# Altium project SplitHE_Int.PrjPcb
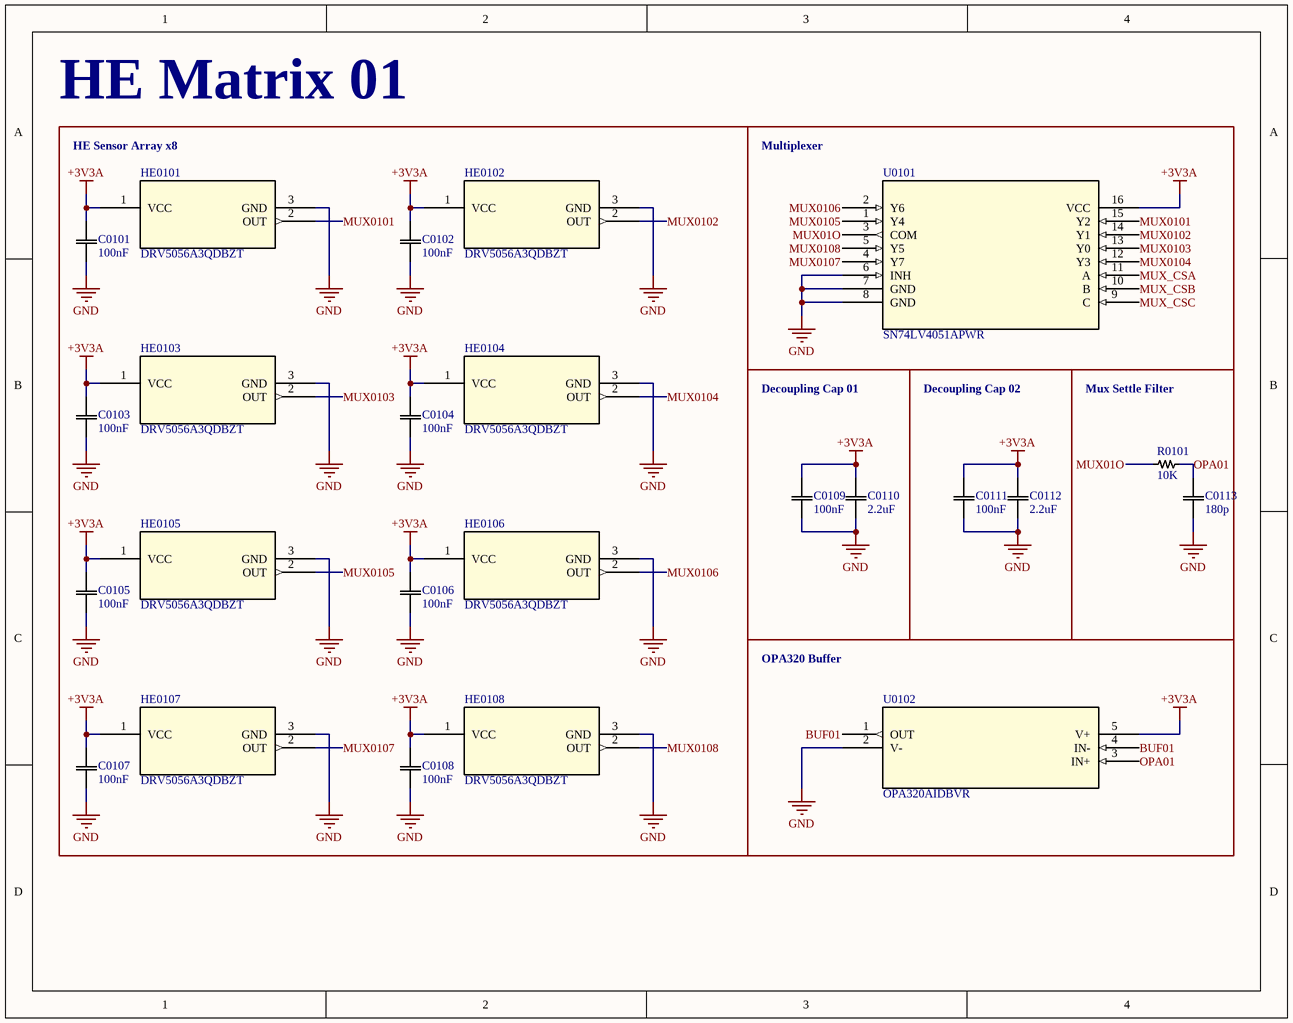
[diagram p0: sensor_matrix_01.SchDoc]
5 sheets, 121 parts. Net scope: global (net labels, ports and power ports of the same name join across sheets).
Board file: main.PcbDoc
Sheets:
  sensor_matrix_01.SchDoc
  sensor_matrix_02.SchDoc
  sensor_matrix_03.SchDoc
  rp2040_core.SchDoc
  peripherals.SchDoc

## Sheet sensor_matrix_01.SchDoc
size A; SheetNumber: 1; SheetTotal: 5

### Parts
C0101  100nF  [CAPC10555_55N_KEM]
C0102  100nF  [CAPC10555_55N_KEM]
C0103  100nF  [CAPC10555_55N_KEM]
C0104  100nF  [CAPC10555_55N_KEM]
C0105  100nF  [CAPC10555_55N_KEM]
C0106  100nF  [CAPC10555_55N_KEM]
C0107  100nF  [CAPC10555_55N_KEM]
C0108  100nF  [CAPC10555_55N_KEM]
C0109  100nF  [CAPC10555_55N_KEM]
C0110  2.2uF  [CAPC10555_55N_KEM]
C0111  100nF  [CAPC10555_55N_KEM]
C0112  2.2uF  [CAPC10555_55N_KEM]
C0113  180p  [CAPC10555_55N_KEM]
HE0101  DRV5056A3QDBZT  [DBZ3_TEX]
HE0102  DRV5056A3QDBZT  [DBZ3_TEX]
HE0103  DRV5056A3QDBZT  [DBZ3_TEX]
HE0104  DRV5056A3QDBZT  [DBZ3_TEX]
HE0105  DRV5056A3QDBZT  [DBZ3_TEX]
HE0106  DRV5056A3QDBZT  [DBZ3_TEX]
HE0107  DRV5056A3QDBZT  [DBZ3_TEX]
HE0108  DRV5056A3QDBZT  [DBZ3_TEX]
R0101  10K  [RES0402_CPF_TYCO_TYC]
U0101  SN74LV4051APWR  [PW16]
U0102  OPA320AIDBVR  [DBV5]

### Blocks framed on the sheet
HE Matrix 01: C0101 C0102 C0103 C0104 C0105 C0106 C0107 C0108 HE0101 HE0102 HE0103 HE0104 HE0105 HE0106 HE0107 HE0108
Multiplexer: U0101
OPA320 Buffer: U0102

### Nets
+3V3A: C0101.2 C0102.2 C0103.2 C0104.2 C0105.2 C0106.2 C0107.2 C0108.2 C0109.2 C0110.2 C0111.2 C0112.2 HE0101.1(VCC) HE0102.1(VCC) HE0103.1(VCC) HE0104.1(VCC) HE0105.1(VCC) HE0106.1(VCC) HE0107.1(VCC) HE0108.1(VCC) U0101.16(VCC) U0102.5(V+)
GND: C0101.1 C0102.1 C0103.1 C0104.1 C0105.1 C0106.1 C0107.1 C0108.1 C0109.1 C0110.1 C0111.1 C0112.1 C0113.1 HE0101.3(GND) HE0102.3(GND) HE0103.3(GND) HE0104.3(GND) HE0105.3(GND) HE0106.3(GND) HE0107.3(GND) HE0108.3(GND) U0101.6(INH) U0101.7(GND) U0101.8(GND) U0102.2(V-)
BUF01: U0102.1(OUT) U0102.4(IN-)
MUX01O: R0101.2 U0101.3(COM)
MUX0101: HE0101.2(OUT) U0101.15(Y2)
MUX0102: HE0102.2(OUT) U0101.14(Y1)
MUX0103: HE0103.2(OUT) U0101.13(Y0)
MUX0104: HE0104.2(OUT) U0101.12(Y3)
MUX0105: HE0105.2(OUT) U0101.1(Y4)
MUX0106: HE0106.2(OUT) U0101.2(Y6)
MUX0107: HE0107.2(OUT) U0101.4(Y7)
MUX0108: HE0108.2(OUT) U0101.5(Y5)
MUX_CSA: U0101.11(A)
MUX_CSB: U0101.10(B)
MUX_CSC: U0101.9(C)
OPA01: C0113.2 R0101.1 U0102.3(IN+)

### Notes on the sheet
- HE Sensor Array x8
- Decoupling Cap 01
- Decoupling Cap 02
- Mux Settle Filter

### Library data of the parts
C0101 C0102 C0103 C0104 C0105 C0106 C0107 C0108 C0109 C0110 C0111 C0112 C0113 = C0402: SMD Comm X7R, Ceramic, SMD, MLCC, Temperature Stable, 0402; Manufacturer_Name: Kemet; Manufacturer_Part_Number: C0402C104K4RACTU; Copyright: Copyright (C) 2025 Ultra Librarian. All rights reserved.; Datasheet: https://content.kemet.com/datasheets/KEM_C1002_X7R_SMD.pdf
HE0101 HE0102 HE0103 HE0104 HE0105 HE0106 HE0107 HE0108 = DRV5056A3QDBZT: Ratiometric unipolar linear hall effect sensor with analog output 3-SOT-23 -40 to 125; Manufacturer_Name: Texas Instruments; Copyright: Copyright (C) 2025 Ultra Librarian. All rights reserved.; Manufacturer_Part_Number: DRV5056A3QDBZT; Datasheet: https://www.ti.com/lit/gpn/drv5056; RefDes: RefDes; Type: Type
R0101 = R0402: CPF 0402 RL; Manufacturer_Name: TE Connectivity; Manufacturer_Part_Number: CPF0402B33RE1; Copyright: Copyright (C) 2025 Ultra Librarian. All rights reserved.; Datasheet: https://www.te.com/commerce/DocumentDelivery/DDEController?Action=srchrtrv&DocNm=1773200&DocType=Data+Sheet&DocLang=English&PartCntxt=1-1879208-3&DocFormat=pdf
U0101 = SN74LV4051APWR: 5V 8:1 one-channel general-purpose analog multiplexer 16-TSSOP -40 to 85; Manufacturer_Name: Texas Instruments; Copyright: Copyright (C) 2025 Ultra Librarian. All rights reserved.; Manufacturer_Part_Number: SN74LV4051APWR; Datasheet: https://www.ti.com/lit/gpn/sn74lv4051a; RefDes: RefDes; Type: Type
U0102 = OPA320AIDBVR: Precision, zero-crossover, 20-MHz, 0.9-pA Ib, RRIO, CMOS operational amplifier 5-SOT-23 -40 to 125; Manufacturer_Name: Texas Instruments; Copyright: Copyright (C) 2025 Ultra Librarian. All rights reserved.; Manufacturer_Part_Number: OPA320AIDBVR; Datasheet: https://www.ti.com/lit/gpn/opa320; RefDes: RefDes; Type: Type

## Sheet sensor_matrix_02.SchDoc
size A; SheetNumber: 2; SheetTotal: 5
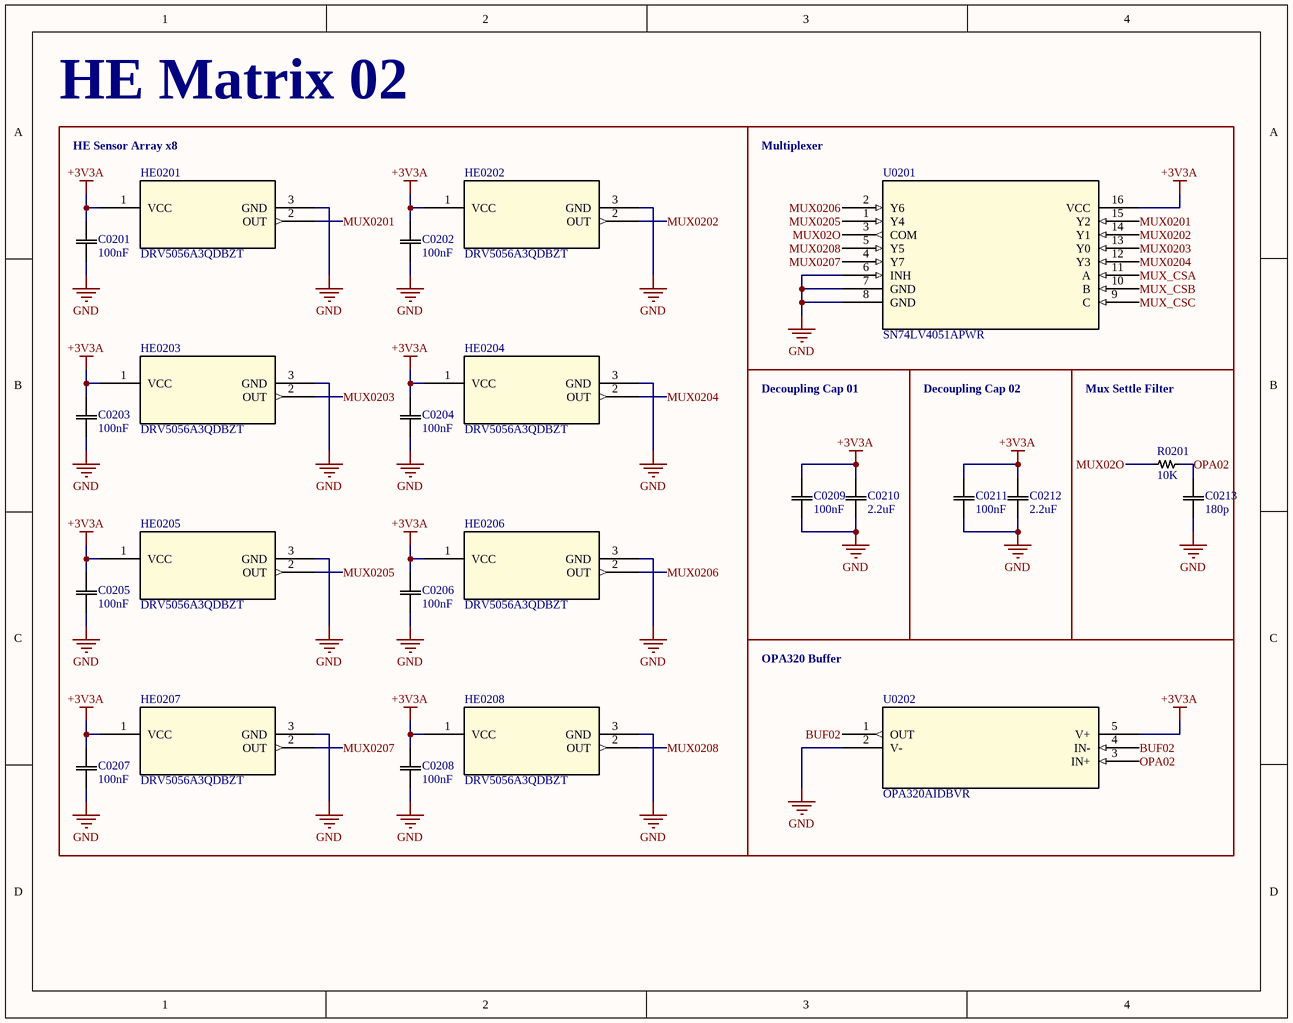
[diagram p1: sensor_matrix_02.SchDoc]

### Parts
C0201  100nF  [CAPC10555_55N_KEM]
C0202  100nF  [CAPC10555_55N_KEM]
C0203  100nF  [CAPC10555_55N_KEM]
C0204  100nF  [CAPC10555_55N_KEM]
C0205  100nF  [CAPC10555_55N_KEM]
C0206  100nF  [CAPC10555_55N_KEM]
C0207  100nF  [CAPC10555_55N_KEM]
C0208  100nF  [CAPC10555_55N_KEM]
C0209  100nF  [CAPC10555_55N_KEM]
C0210  2.2uF  [CAPC10555_55N_KEM]
C0211  100nF  [CAPC10555_55N_KEM]
C0212  2.2uF  [CAPC10555_55N_KEM]
C0213  180p  [CAPC10555_55N_KEM]
HE0201  DRV5056A3QDBZT  [DBZ3_TEX]
HE0202  DRV5056A3QDBZT  [DBZ3_TEX]
HE0203  DRV5056A3QDBZT  [DBZ3_TEX]
HE0204  DRV5056A3QDBZT  [DBZ3_TEX]
HE0205  DRV5056A3QDBZT  [DBZ3_TEX]
HE0206  DRV5056A3QDBZT  [DBZ3_TEX]
HE0207  DRV5056A3QDBZT  [DBZ3_TEX]
HE0208  DRV5056A3QDBZT  [DBZ3_TEX]
R0201  10K  [RES0402_CPF_TYCO_TYC]
U0201  SN74LV4051APWR  [PW16]
U0202  OPA320AIDBVR  [DBV5]

### Blocks framed on the sheet
HE Matrix 02: C0201 C0202 C0203 C0204 C0205 C0206 C0207 C0208 HE0201 HE0202 HE0203 HE0204 HE0205 HE0206 HE0207 HE0208
Multiplexer: U0201
OPA320 Buffer: U0202

### Nets
+3V3A: C0201.2 C0202.2 C0203.2 C0204.2 C0205.2 C0206.2 C0207.2 C0208.2 C0209.2 C0210.2 C0211.2 C0212.2 HE0201.1(VCC) HE0202.1(VCC) HE0203.1(VCC) HE0204.1(VCC) HE0205.1(VCC) HE0206.1(VCC) HE0207.1(VCC) HE0208.1(VCC) U0201.16(VCC) U0202.5(V+)
GND: C0201.1 C0202.1 C0203.1 C0204.1 C0205.1 C0206.1 C0207.1 C0208.1 C0209.1 C0210.1 C0211.1 C0212.1 C0213.1 HE0201.3(GND) HE0202.3(GND) HE0203.3(GND) HE0204.3(GND) HE0205.3(GND) HE0206.3(GND) HE0207.3(GND) HE0208.3(GND) U0201.6(INH) U0201.7(GND) U0201.8(GND) U0202.2(V-)
BUF02: U0202.1(OUT) U0202.4(IN-)
MUX02O: R0201.2 U0201.3(COM)
MUX0201: HE0201.2(OUT) U0201.15(Y2)
MUX0202: HE0202.2(OUT) U0201.14(Y1)
MUX0203: HE0203.2(OUT) U0201.13(Y0)
MUX0204: HE0204.2(OUT) U0201.12(Y3)
MUX0205: HE0205.2(OUT) U0201.1(Y4)
MUX0206: HE0206.2(OUT) U0201.2(Y6)
MUX0207: HE0207.2(OUT) U0201.4(Y7)
MUX0208: HE0208.2(OUT) U0201.5(Y5)
MUX_CSA: U0201.11(A)
MUX_CSB: U0201.10(B)
MUX_CSC: U0201.9(C)
OPA02: C0213.2 R0201.1 U0202.3(IN+)

### Notes on the sheet
- HE Sensor Array x8
- Decoupling Cap 01
- Decoupling Cap 02
- Mux Settle Filter

### Library data of the parts
C0201 C0202 C0203 C0204 C0205 C0206 C0207 C0208 C0209 C0210 C0211 C0212 C0213 = C0402: as C0101 on sheet sensor_matrix_01; Copyright: Copyright (C) 2025 Ultra Librarian. All rights reserved.; Datasheet: https://content.kemet.com/datasheets/KEM_C1002_X7R_SMD.pdf
HE0201 HE0202 HE0203 HE0204 HE0205 HE0206 HE0207 HE0208 = DRV5056A3QDBZT: as HE0101 on sheet sensor_matrix_01; Copyright: Copyright (C) 2025 Ultra Librarian. All rights reserved.; Manufacturer_Part_Number: DRV5056A3QDBZT; Datasheet: https://www.ti.com/lit/gpn/drv5056; RefDes: RefDes; Type: Type
R0201 = R0402: as R0101 on sheet sensor_matrix_01; Copyright: Copyright (C) 2025 Ultra Librarian. All rights reserved.; Datasheet: https://www.te.com/commerce/DocumentDelivery/DDEController?Action=srchrtrv&DocNm=1773200&DocType=Data+Sheet&DocLang=English&PartCntxt=1-1879208-3&DocFormat=pdf
U0201 = SN74LV4051APWR: as U0101 on sheet sensor_matrix_01; Copyright: Copyright (C) 2025 Ultra Librarian. All rights reserved.; Manufacturer_Part_Number: SN74LV4051APWR; Datasheet: https://www.ti.com/lit/gpn/sn74lv4051a; RefDes: RefDes; Type: Type
U0202 = OPA320AIDBVR: as U0102 on sheet sensor_matrix_01; Copyright: Copyright (C) 2025 Ultra Librarian. All rights reserved.; Manufacturer_Part_Number: OPA320AIDBVR; Datasheet: https://www.ti.com/lit/gpn/opa320; RefDes: RefDes; Type: Type

## Sheet sensor_matrix_03.SchDoc
size A; SheetNumber: 3; SheetTotal: 5
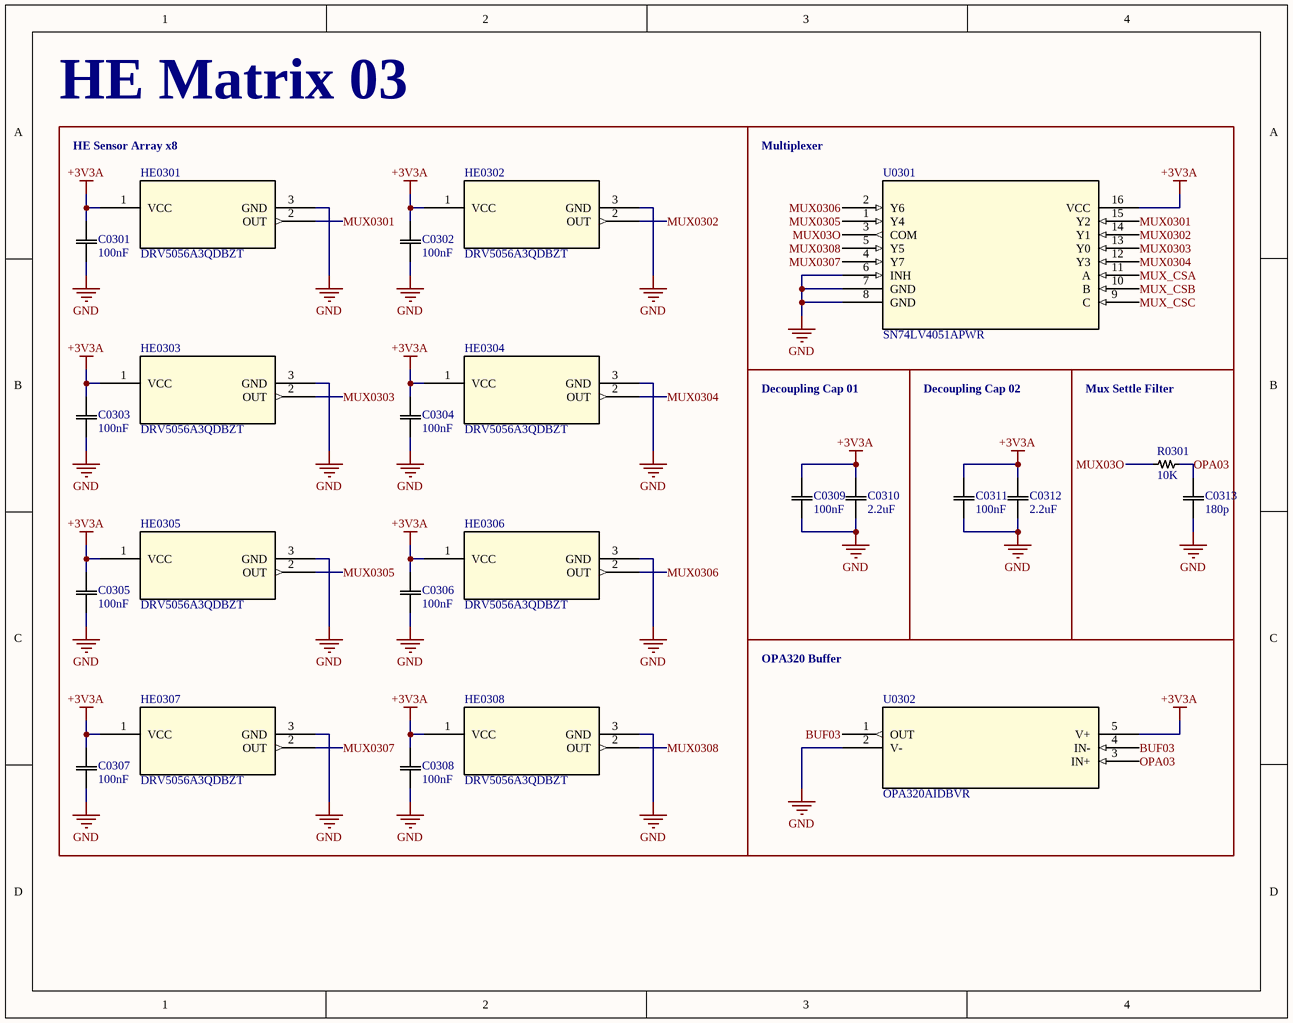
[diagram p2: sensor_matrix_03.SchDoc]

### Parts
C0301  100nF  [CAPC10555_55N_KEM]
C0302  100nF  [CAPC10555_55N_KEM]
C0303  100nF  [CAPC10555_55N_KEM]
C0304  100nF  [CAPC10555_55N_KEM]
C0305  100nF  [CAPC10555_55N_KEM]
C0306  100nF  [CAPC10555_55N_KEM]
C0307  100nF  [CAPC10555_55N_KEM]
C0308  100nF  [CAPC10555_55N_KEM]
C0309  100nF  [CAPC10555_55N_KEM]
C0310  2.2uF  [CAPC10555_55N_KEM]
C0311  100nF  [CAPC10555_55N_KEM]
C0312  2.2uF  [CAPC10555_55N_KEM]
C0313  180p  [CAPC10555_55N_KEM]
HE0301  DRV5056A3QDBZT  [DBZ3_TEX]
HE0302  DRV5056A3QDBZT  [DBZ3_TEX]
HE0303  DRV5056A3QDBZT  [DBZ3_TEX]
HE0304  DRV5056A3QDBZT  [DBZ3_TEX]
HE0305  DRV5056A3QDBZT  [DBZ3_TEX]
HE0306  DRV5056A3QDBZT  [DBZ3_TEX]
HE0307  DRV5056A3QDBZT  [DBZ3_TEX]
HE0308  DRV5056A3QDBZT  [DBZ3_TEX]
R0301  10K  [RES0402_CPF_TYCO_TYC]
U0301  SN74LV4051APWR  [PW16]
U0302  OPA320AIDBVR  [DBV5]

### Blocks framed on the sheet
HE Matrix 03: C0301 C0302 C0303 C0304 C0305 C0306 C0307 C0308 HE0301 HE0302 HE0303 HE0304 HE0305 HE0306 HE0307 HE0308
Multiplexer: U0301
OPA320 Buffer: U0302

### Nets
+3V3A: C0301.2 C0302.2 C0303.2 C0304.2 C0305.2 C0306.2 C0307.2 C0308.2 C0309.2 C0310.2 C0311.2 C0312.2 HE0301.1(VCC) HE0302.1(VCC) HE0303.1(VCC) HE0304.1(VCC) HE0305.1(VCC) HE0306.1(VCC) HE0307.1(VCC) HE0308.1(VCC) U0301.16(VCC) U0302.5(V+)
GND: C0301.1 C0302.1 C0303.1 C0304.1 C0305.1 C0306.1 C0307.1 C0308.1 C0309.1 C0310.1 C0311.1 C0312.1 C0313.1 HE0301.3(GND) HE0302.3(GND) HE0303.3(GND) HE0304.3(GND) HE0305.3(GND) HE0306.3(GND) HE0307.3(GND) HE0308.3(GND) U0301.6(INH) U0301.7(GND) U0301.8(GND) U0302.2(V-)
BUF03: U0302.1(OUT) U0302.4(IN-)
MUX03O: R0301.2 U0301.3(COM)
MUX0301: HE0301.2(OUT) U0301.15(Y2)
MUX0302: HE0302.2(OUT) U0301.14(Y1)
MUX0303: HE0303.2(OUT) U0301.13(Y0)
MUX0304: HE0304.2(OUT) U0301.12(Y3)
MUX0305: HE0305.2(OUT) U0301.1(Y4)
MUX0306: HE0306.2(OUT) U0301.2(Y6)
MUX0307: HE0307.2(OUT) U0301.4(Y7)
MUX0308: HE0308.2(OUT) U0301.5(Y5)
MUX_CSA: U0301.11(A)
MUX_CSB: U0301.10(B)
MUX_CSC: U0301.9(C)
OPA03: C0313.2 R0301.1 U0302.3(IN+)

### Notes on the sheet
- HE Sensor Array x8
- Decoupling Cap 01
- Decoupling Cap 02
- Mux Settle Filter

### Library data of the parts
C0301 C0302 C0303 C0304 C0305 C0306 C0307 C0308 C0309 C0310 C0311 C0312 C0313 = C0402: as C0101 on sheet sensor_matrix_01; Copyright: Copyright (C) 2025 Ultra Librarian. All rights reserved.; Datasheet: https://content.kemet.com/datasheets/KEM_C1002_X7R_SMD.pdf
HE0301 HE0302 HE0303 HE0304 HE0305 HE0306 HE0307 HE0308 = DRV5056A3QDBZT: as HE0101 on sheet sensor_matrix_01; Copyright: Copyright (C) 2025 Ultra Librarian. All rights reserved.; Manufacturer_Part_Number: DRV5056A3QDBZT; Datasheet: https://www.ti.com/lit/gpn/drv5056; RefDes: RefDes; Type: Type
R0301 = R0402: as R0101 on sheet sensor_matrix_01; Copyright: Copyright (C) 2025 Ultra Librarian. All rights reserved.; Datasheet: https://www.te.com/commerce/DocumentDelivery/DDEController?Action=srchrtrv&DocNm=1773200&DocType=Data+Sheet&DocLang=English&PartCntxt=1-1879208-3&DocFormat=pdf
U0301 = SN74LV4051APWR: as U0101 on sheet sensor_matrix_01; Copyright: Copyright (C) 2025 Ultra Librarian. All rights reserved.; Manufacturer_Part_Number: SN74LV4051APWR; Datasheet: https://www.ti.com/lit/gpn/sn74lv4051a; RefDes: RefDes; Type: Type
U0302 = OPA320AIDBVR: as U0102 on sheet sensor_matrix_01; Copyright: Copyright (C) 2025 Ultra Librarian. All rights reserved.; Manufacturer_Part_Number: OPA320AIDBVR; Datasheet: https://www.ti.com/lit/gpn/opa320; RefDes: RefDes; Type: Type

## Sheet rp2040_core.SchDoc
size A; SheetNumber: 4; SheetTotal: 5
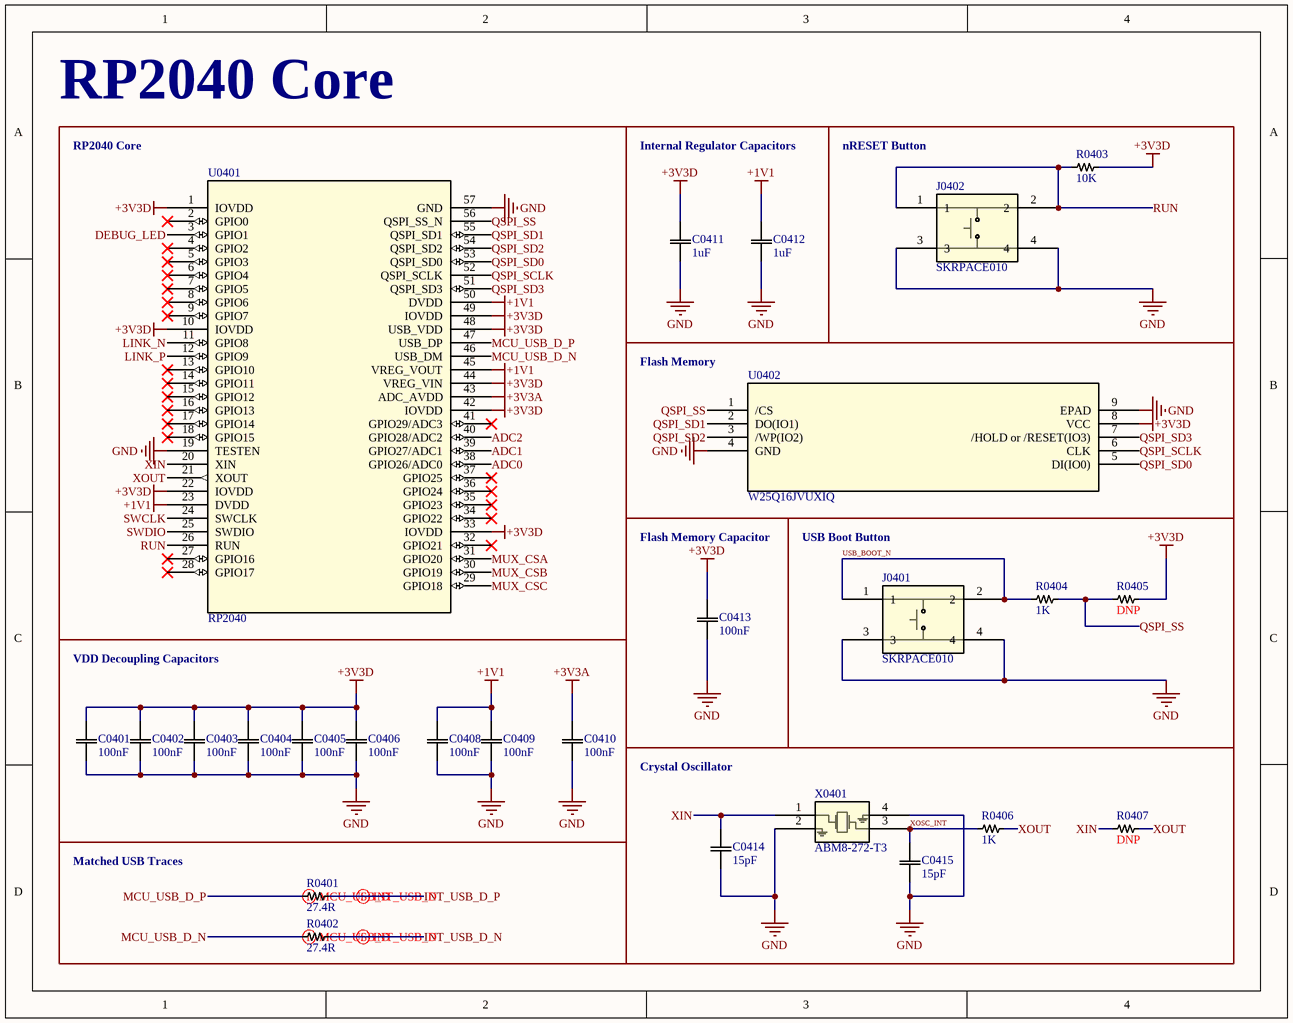
[diagram p3: rp2040_core.SchDoc]

### Parts
C0401  100nF  [CAPC10555_55N_KEM]
C0402  100nF  [CAPC10555_55N_KEM]
C0403  100nF  [CAPC10555_55N_KEM]
C0404  100nF  [CAPC10555_55N_KEM]
C0405  100nF  [CAPC10555_55N_KEM]
C0406  100nF  [CAPC10555_55N_KEM]
C0408  100nF  [CAPC10555_55N_KEM]
C0409  100nF  [CAPC10555_55N_KEM]
C0410  100nF  [CAPC10555_55N_KEM]
C0411  1uF  [CAPC10555_55N_KEM]
C0412  1uF  [CAPC10555_55N_KEM]
C0413  100nF  [CAPC10555_55N_KEM]
C0414  15pF  [CAPC10555_55N_KEM]
C0415  15pF  [CAPC10555_55N_KEM]
J0401  SKRPACE010  [SW_SKRPACE010_AAL]
J0402  SKRPACE010  [SW_SKRPACE010_AAL]
R0401  27.4R  [RES0402_CPF_TYCO_TYC]
R0402  27.4R  [RES0402_CPF_TYCO_TYC]
R0403  10K  [RC0603N_YAG]
R0404  1K  [RC0603N_YAG]
R0405  DNP  [RES0402_CPF_TYCO_TYC]
R0406  1K  [RES0402_CPF_TYCO_TYC]
R0407  DNP  [RES0402_CPF_TYCO_TYC]
U0401  RP2040  [IC57_RP2040]
U0402  W25Q16JVUXIQ  [W25Q16JVUXIQ_WIN]
X0401  ABM8-272-T3  [ABM8-272-T3_ABR]

### Blocks framed on the sheet
RP2040 Core: U0401
Internal Regulator Capacitors: C0411 C0412
nRESET Button: J0402 R0403
Flash Memory: U0402
Flash Memory Capacitor: C0413
USB Boot Button: J0401 R0404 R0405
VDD Decoupling Capacitors: C0401 C0402 C0403 C0404 C0405 C0406 C0408 C0409 C0410
Crystal Oscillator: C0414 C0415 R0406 R0407 X0401
Matched USB Traces: R0401 R0402

### Nets
+1V1: C0408.2 C0409.2 C0412.2 U0401.23(DVDD) U0401.45(VREG_VOUT) U0401.50(DVDD)
+3V3A: C0410.2 U0401.43(ADC_AVDD)
+3V3D: C0401.2 C0402.2 C0403.2 C0404.2 C0405.2 C0406.2 C0411.2 C0413.2 R0403.1 R0405.1 U0401.1(IOVDD) U0401.10(IOVDD) U0401.22(IOVDD) U0401.33(IOVDD) U0401.42(IOVDD) U0401.44(VREG_VIN) U0401.48(USB_VDD) U0401.49(IOVDD) U0402.8(VCC)
GND: C0401.1 C0402.1 C0403.1 C0404.1 C0405.1 C0406.1 C0408.1 C0409.1 C0410.1 C0411.1 C0412.1 C0413.1 C0414.2 C0415.1 J0401.3 J0401.4 J0402.3 J0402.4 U0401.19(TESTEN) U0401.57(GND) U0402.4(GND) U0402.9(EPAD) X0401.2 X0401.4
ADC0: U0401.38(GPIO26/ADC0)
ADC1: U0401.39(GPIO27/ADC1)
ADC2: U0401.40(GPIO28/ADC2)
DEBUG_LED: U0401.3(GPIO1)
INT_USB_D_N: R0402.1
INT_USB_D_P: R0401.1
LINK_N: U0401.11(GPIO8)
LINK_P: U0401.12(GPIO9)
MCU_USB_D_N: R0402.2 U0401.46(USB_DM)
MCU_USB_D_P: R0401.2 U0401.47(USB_DP)
MUX_CSA: U0401.31(GPIO20)
MUX_CSB: U0401.30(GPIO19)
MUX_CSC: U0401.29(GPIO18)
QSPI_SCLK: U0401.52(QSPI_SCLK) U0402.6(CLK)
QSPI_SD0: U0401.53(QSPI_SD0) U0402.5(DI(IO0))
QSPI_SD1: U0401.55(QSPI_SD1) U0402.2(DO(IO1))
QSPI_SD2: U0401.54(QSPI_SD2) U0402.3(/WP(IO2))
QSPI_SD3: U0401.51(QSPI_SD3) U0402.7(/HOLD_or_/RESET(IO3))
QSPI_SS: R0404.1 R0405.2 U0401.56(QSPI_SS_N) U0402.1(/CS)
RUN: J0402.1 J0402.2 R0403.2 U0401.26(RUN)
SWCLK: U0401.24(SWCLK)
SWDIO: U0401.25(SWDIO)
USB_BOOT_N: J0401.1 J0401.2 R0404.2
XIN: C0414.1 R0407.1 U0401.20(XIN) X0401.1
XOSC_INT: C0415.2 R0406.1 X0401.3
XOUT: R0406.2 R0407.2 U0401.21(XOUT)

Not connected (* = marked no-connect by the designer): U0401 2(GPIO0)* 4(GPIO2)* 5(GPIO3)* 6(GPIO4)* 7(GPIO5)* 8(GPIO6)* 9(GPIO7)* 13(GPIO10)* 14(GPIO11)* 15(GPIO12)* 16(GPIO13)* 17(GPIO14)* 18(GPIO15)* 27(GPIO16)* 28(GPIO17)* 32(GPIO21)* 34(GPIO22)* 35(GPIO23)* 36(GPIO24)* 37(GPIO25)* 41(GPIO29/ADC3)*

### Layout directives
differential pair: INT_USB_D_N, INT_USB_D_P, MCU_USB_D_N, MCU_USB_D_P

### Notes on the sheet
- RP2040 Core

### Library data of the parts
C0401 C0402 C0403 C0404 C0405 C0406 C0408 C0409 C0410 C0411 C0412 C0413 C0414 C0415 = C0402: as C0101 on sheet sensor_matrix_01; Copyright: Copyright (C) 2025 Ultra Librarian. All rights reserved.; Datasheet: https://content.kemet.com/datasheets/KEM_C1002_X7R_SMD.pdf
J0401 J0402 = SKRPACE010: No Description Available; Manufacturer_Name: Alps Electric; Copyright: Copyright (C) 2025 Ultra Librarian. All rights reserved.; Manufacturer_Part_Number: SKRPACE010; RefDes: RefDes; Type: Type
R0401 R0402 R0405 R0406 R0407 = R0402: as R0101 on sheet sensor_matrix_01; Copyright: Copyright (C) 2025 Ultra Librarian. All rights reserved.; Datasheet: https://www.te.com/commerce/DocumentDelivery/DDEController?Action=srchrtrv&DocNm=1773200&DocType=Data+Sheet&DocLang=English&PartCntxt=1-1879208-3&DocFormat=pdf
R0403 R0404 = RC0603: RES SMD 47K OHM 1% 1/10W 0603; Manufacturer_Name: Yageo; Manufacturer_Part_Number: RC0603FR-0747KL; Copyright: Copyright (C) 2025 Ultra Librarian. All rights reserved.
U0401 = RP2040: No Description Available; Manufacturer_Name: Raspberry Pi; Copyright: Copyright (C) 2025 Ultra Librarian. All rights reserved.; Manufacturer_Part_Number: RP2040; RefDes: RefDes; Type: Type
U0402 = W25Q16JVUXIQ: No Description Available; Manufacturer_Name: Winbond; Copyright: Copyright (C) 2025 Ultra Librarian. All rights reserved.; Manufacturer_Part_Number: W25Q16JVUXIQ; RefDes: RefDes; Type: Type
X0401 = ABM8-272-T3: No Description Available; Manufacturer_Name: Abracon; Type: Crystals; Copyright: Copyright (C) 2025 Ultra Librarian. All rights reserved.; Manufacturer_Part_Number: ABM8-272-T3; RefDes: RefDes

## Sheet peripherals.SchDoc
size A; SheetNumber: 5; SheetTotal: 5
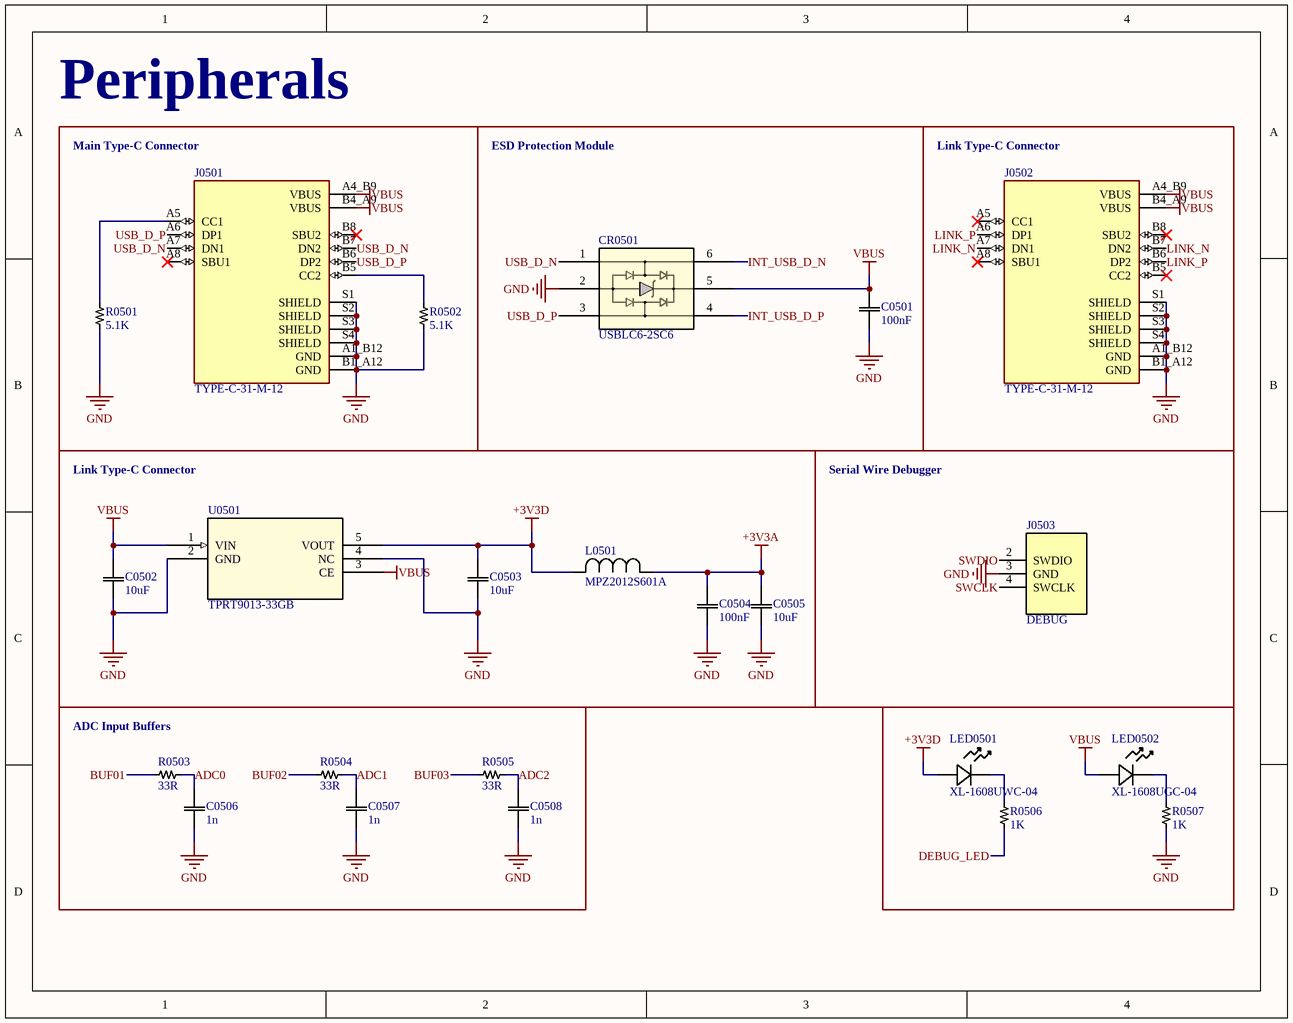
[diagram p4: peripherals.SchDoc]

### Parts
C0501  100nF  [CAPC10555_55N_KEM]
C0502  10uF  [CAPC10555_55N_KEM]
C0503  10uF  [CAPC10555_55N_KEM]
C0504  100nF  [CAPC10555_55N_KEM]
C0505  10uF  [CAPC10555_55N_KEM]
C0506  1n  [CAPC10555_55N_KEM]
C0507  1n  [CAPC10555_55N_KEM]
C0508  1n  [CAPC10555_55N_KEM]
CR0501  USBLC6-2SC6  [SOT23-6L_STM]
J0501  TYPE-C-31-M-12  [HRO_TYPE-C-31-M-12]
J0502  TYPE-C-31-M-12  [HRO_TYPE-C-31-M-12]
J0503  DEBUG  [SW_Debugger_3P]
L0501  MPZ2012S601A  [IND_MPZ2012_TDK]
LED0501  XL-1608UWC-04  [LED_XL-1608_XLG]
LED0502  XL-1608UGC-04  [LED_XL-1608_XLG]
R0501  5.1K  [RES0402_CPF_TYCO_TYC]
R0502  5.1K  [RES0402_CPF_TYCO_TYC]
R0503  33R  [RES0402_CPF_TYCO_TYC]
R0504  33R  [RES0402_CPF_TYCO_TYC]
R0505  33R  [RES0402_CPF_TYCO_TYC]
R0506  1K  [RES0402_CPF_TYCO_TYC]
R0507  1K  [RES0402_CPF_TYCO_TYC]
U0501  TPRT9013-33GB  [SOT23-5_TCP]

### Blocks framed on the sheet
Peripherals: J0501 R0501 R0502
ESD Protection Module: C0501 CR0501
Link Type-C Connector: J0502
Link Type-C Connector: C0502 C0503 C0504 C0505 L0501 U0501
Serial Wire Debugger: J0503
ADC Input Buffers: C0506 C0507 C0508 R0503 R0504 R0505

### Nets
+3V3A: C0504.2 C0505.2 L0501.1
+3V3D: C0503.2 L0501.2 LED0501.2(ANODE) U0501.5(VOUT)
GND: C0501.1 C0502.1 C0503.1 C0504.1 C0505.1 C0506.1 C0507.1 C0508.1 CR0501.2 J0501.A1_B12(GND) J0501.B1_A12(GND) J0501.S1(SHIELD) J0501.S2(SHIELD) J0501.S3(SHIELD) J0501.S4(SHIELD) J0502.A1_B12(GND) J0502.B1_A12(GND) J0502.S1(SHIELD) J0502.S2(SHIELD) J0502.S3(SHIELD) J0502.S4(SHIELD) J0503.3(GND) R0501.1 R0502.1 R0507.2 U0501.2(GND) U0501.4(NC)
VBUS: C0501.2 C0502.2 CR0501.5 J0501.A4_B9(VBUS) J0501.B4_A9(VBUS) J0502.A4_B9(VBUS) J0502.B4_A9(VBUS) LED0502.2(ANODE) U0501.1(VIN) U0501.3(CE)
ADC0: C0506.2 R0503.1
ADC1: C0507.2 R0504.1
ADC2: C0508.2 R0505.1
BUF01: R0503.2
BUF02: R0504.2
BUF03: R0505.2
DEBUG_LED: R0506.2
INT_USB_D_N: CR0501.6
INT_USB_D_P: CR0501.4
LINK_N: J0502.A7(DN1) J0502.B7(DN2)
LINK_P: J0502.A6(DP1) J0502.B6(DP2)
SWCLK: J0503.4(SWCLK)
SWDIO: J0503.2(SWDIO)
USB_D_N: CR0501.1 J0501.A7(DN1) J0501.B7(DN2)
USB_D_P: CR0501.3 J0501.A6(DP1) J0501.B6(DP2)
NetJ0501_A5: J0501.A5(CC1) R0501.2
NetJ0501_B5: J0501.B5(CC2) R0502.2
NetLED0501_1: LED0501.1(CATHODE) R0506.1
NetLED0502_1: LED0502.1(CATHODE) R0507.1

Not connected (* = marked no-connect by the designer): J0501 A8(SBU1)* B8(SBU2)*; J0502 A5(CC1)* A8(SBU1)* B5(CC2)* B8(SBU2)*

### Notes on the sheet
- (near J0501) Main Type-C Connector

### Library data of the parts
C0501 C0502 C0503 C0504 C0505 C0506 C0507 C0508 = C0402: as C0101 on sheet sensor_matrix_01; Copyright: Copyright (C) 2025 Ultra Librarian. All rights reserved.; Datasheet: https://content.kemet.com/datasheets/KEM_C1002_X7R_SMD.pdf
CR0501 = USBLC6-2SC6: ESD Protection for USB 2.0 High Speed; Manufacturer_Name: STMicroelectronics; Copyright: Copyright (C) 2025 Ultra Librarian. All rights reserved.; Manufacturer_Part_Number: USBLC6-2SC6; Datasheet: https://www.st.com/resource/en/datasheet/usblc6-2.pdf; RefDes: RefDes; Type: Type
J0501 J0502 = TYPE-C-31-M-12: USB Connectors 24 Receptacle 1 8.94*7.3mm RoHS; MF: HRO Electronics Co., Ltd.; SnapEDA_Link: https://www.snapeda.com/parts/TYPE-C-31-M-12/HRO+Electronics+Co.%252C+Ltd./view-part/?ref=snap; Package: Package; Value: *; MP: TYPE-C-31-M-12; Check_prices: https://www.snapeda.com/parts/TYPE-C-31-M-12/HRO+Electronics+Co.%252C+Ltd./view-part/?ref=eda
J0503 = DEBUG: Back up plan for serial wire debugging
L0501 = MPZ2012S601A: No Description Available; Manufacturer_Name: TDK; Copyright: Copyright (C) 2025 Ultra Librarian. All rights reserved.; Manufacturer_Part_Number: MPZ2012S601A
LED0501 LED0502 = XL-1608UWC-04: No Description Available; Manufacturer_Name: XINGLIGHT; Copyright: Copyright (C) 2025 Ultra Librarian. All rights reserved.; Manufacturer_Part_Number: XL-1608UWC-04
R0501 R0502 R0503 R0504 R0505 R0506 R0507 = R0402: as R0101 on sheet sensor_matrix_01; Copyright: Copyright (C) 2025 Ultra Librarian. All rights reserved.; Datasheet: https://www.te.com/commerce/DocumentDelivery/DDEController?Action=srchrtrv&DocNm=1773200&DocType=Data+Sheet&DocLang=English&PartCntxt=1-1879208-3&DocFormat=pdf
U0501 = TPRT9013-33GB: No Description Available; Manufacturer_Name: Tech Public; Type: Power Management; Copyright: Copyright (C) 2025 Ultra Librarian. All rights reserved.; Manufacturer_Part_Number: TPRT9013-33GB; RefDes: RefDes

## Nets that join several sheets
+3V3A: sensor_matrix_01 (22 pins), sensor_matrix_02 (22 pins), sensor_matrix_03 (22 pins), rp2040_core (C0410.2 U0401.43), peripherals (C0504.2 C0505.2 L0501.1)
+3V3D: rp2040_core (19 pins), peripherals (C0503.2 L0501.2 LED0501.2 U0501.5)
GND: sensor_matrix_01 (25 pins), sensor_matrix_02 (25 pins), sensor_matrix_03 (25 pins), rp2040_core (24 pins), peripherals (27 pins)
ADC0: rp2040_core (U0401.38), peripherals (C0506.2 R0503.1)
ADC1: rp2040_core (U0401.39), peripherals (C0507.2 R0504.1)
ADC2: rp2040_core (U0401.40), peripherals (C0508.2 R0505.1)
BUF01: sensor_matrix_01 (U0102.1 U0102.4), peripherals (R0503.2)
BUF02: sensor_matrix_02 (U0202.1 U0202.4), peripherals (R0504.2)
BUF03: sensor_matrix_03 (U0302.1 U0302.4), peripherals (R0505.2)
DEBUG_LED: rp2040_core (U0401.3), peripherals (R0506.2)
INT_USB_D_N: rp2040_core (R0402.1), peripherals (CR0501.6)
INT_USB_D_P: rp2040_core (R0401.1), peripherals (CR0501.4)
LINK_N: rp2040_core (U0401.11), peripherals (J0502.A7 J0502.B7)
LINK_P: rp2040_core (U0401.12), peripherals (J0502.A6 J0502.B6)
MUX_CSA: sensor_matrix_01 (U0101.11), sensor_matrix_02 (U0201.11), sensor_matrix_03 (U0301.11), rp2040_core (U0401.31)
MUX_CSB: sensor_matrix_01 (U0101.10), sensor_matrix_02 (U0201.10), sensor_matrix_03 (U0301.10), rp2040_core (U0401.30)
MUX_CSC: sensor_matrix_01 (U0101.9), sensor_matrix_02 (U0201.9), sensor_matrix_03 (U0301.9), rp2040_core (U0401.29)
SWCLK: rp2040_core (U0401.24), peripherals (J0503.4)
SWDIO: rp2040_core (U0401.25), peripherals (J0503.2)